# Altium schematic sheet FPGA_51_Serial.SchDoc: LiveDesign Evaluation - Serial
size A4; Organization: Altium Limited; Address1: L3, 12a Rodborough Rd; Address2: Frenchs Forest; Address3: NSW; Address4: Australia 2086; DocumentNumber: 1; SheetNumber: 1; SheetTotal: 7
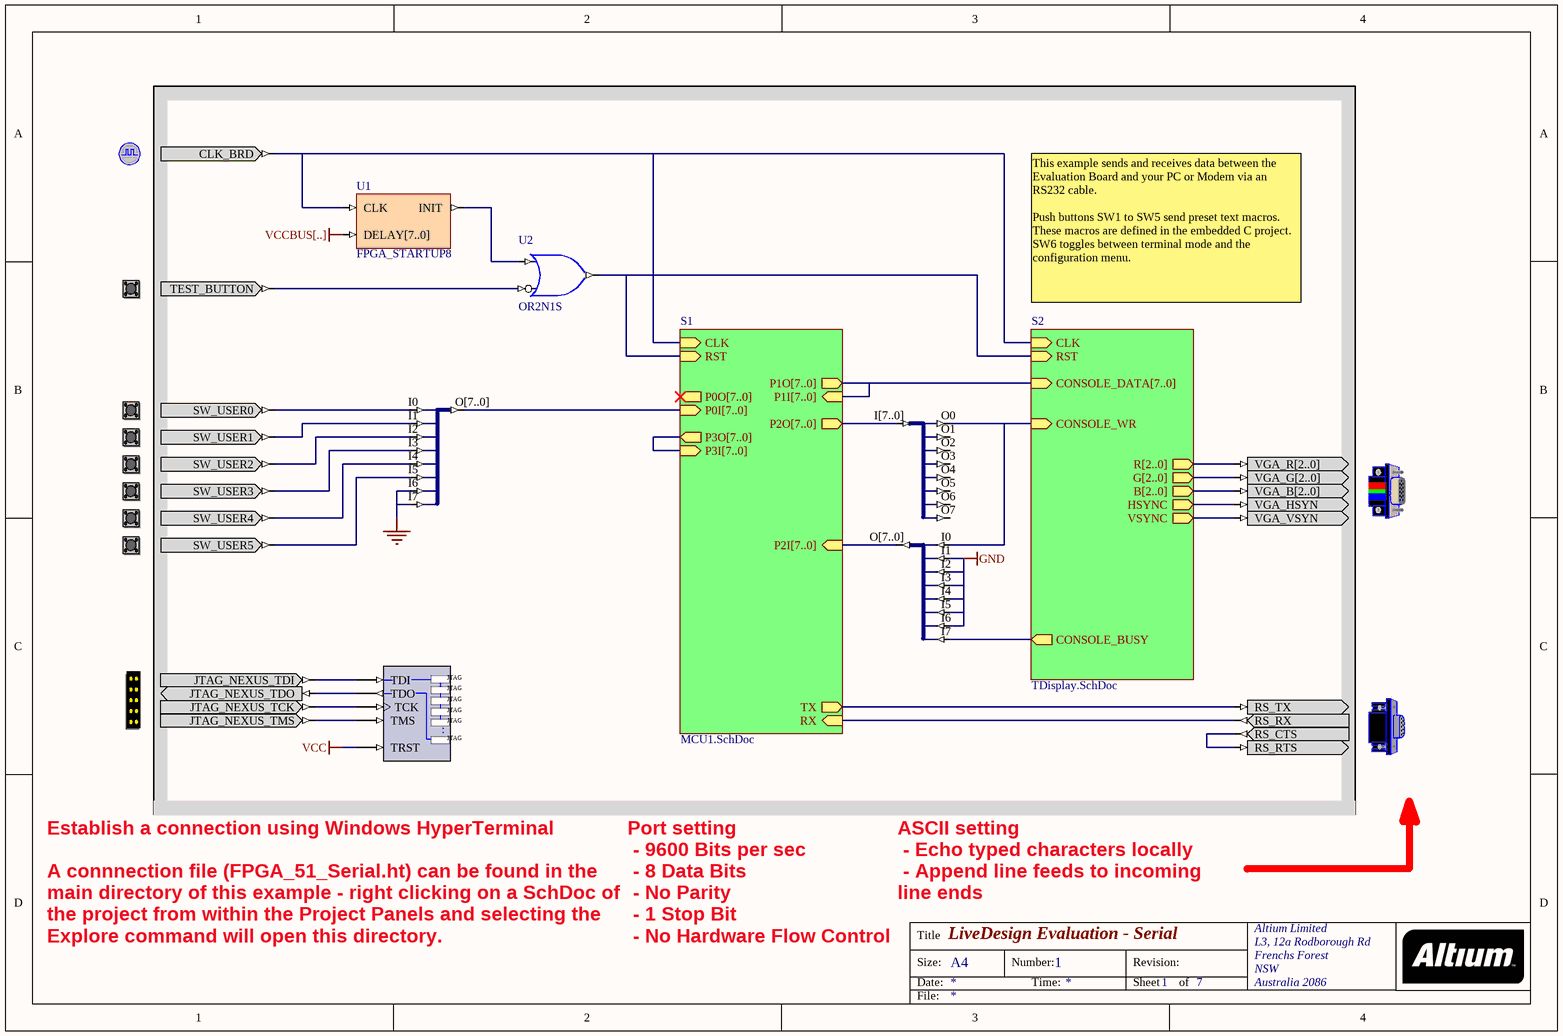
[diagram p0: FPGA_51_Serial.SchDoc]

## Parts
CLOCK_BOARD  CLOCK_BOARD  (value not drawn)
NEXUS_JTAG_CONNECTOR  NEXUS_JTAG_CONNECTOR  (value not drawn)
NEXUS_JTAG_PORT  NEXUS_JTAG_PORT  (value not drawn)
RS232CNTR  RS232CNTR  (value not drawn)
TEST_BUTTON  TEST_BUTTON  (value not drawn)
U1  FPGA_STARTUP8
U2  OR2N1S
U3  J8S_8B  (value not drawn)
U4  J8S_8B  (value not drawn)
U5  J8B_8S  (value not drawn)
USER_BUTTONX6  USER_BUTTONX6  (value not drawn)
VGACNTR  VGACNTR  (value not drawn)

## Sub-sheets
S1 = MCU1.SchDoc: CLK (in), RST (in), P0O[7..0] (out), P0I[7..0] (in), P1O[7..0] (out), P1I[7..0] (in), P2O[7..0] (out), P2I[7..0] (in), P3O[7..0] (out), P3I[7..0] (in), TX (out), RX (in)
S2 = TDisplay.SchDoc: CLK (in), HSYNC (out), VSYNC (out), R[2..0] (out), G[2..0] (out), B[2..0] (out), CONSOLE_WR (in), CONSOLE_DATA[7..0] (in), CONSOLE_BUSY (out), RST (in)

## Nets
GND: U3.I6 U3.I7 U4.I1 U4.I2 U4.I3 U4.I4 U4.I5 U4.I6
VCC: NEXUS_JTAG_PORT.TRST
VCCBUS[..]: U1.DELAY[7..0]
NetCLOCK_BOARD_CLK_BRD: CLOCK_BOARD.CLK_BRD U1.CLK ; sheet S1/CLK, sheet S2/CLK
NetNEXUS_JTAG_CONNECTOR_JTAG_NEXUS_TCK: NEXUS_JTAG_CONNECTOR.JTAG_NEXUS_TCK NEXUS_JTAG_PORT.TCK
NetNEXUS_JTAG_CONNECTOR_JTAG_NEXUS_TDI: NEXUS_JTAG_CONNECTOR.JTAG_NEXUS_TDI NEXUS_JTAG_PORT.TDI
NetNEXUS_JTAG_CONNECTOR_JTAG_NEXUS_TDO: NEXUS_JTAG_CONNECTOR.JTAG_NEXUS_TDO NEXUS_JTAG_PORT.TDO
NetNEXUS_JTAG_CONNECTOR_JTAG_NEXUS_TMS: NEXUS_JTAG_CONNECTOR.JTAG_NEXUS_TMS NEXUS_JTAG_PORT.TMS
NetRS232CNTR_RS_CTS: RS232CNTR.RS_CTS RS232CNTR.RS_RTS
NetRS232CNTR_RS_RX: RS232CNTR.RS_RX ; sheet S1/RX
NetRS232CNTR_RS_TX: RS232CNTR.RS_TX ; sheet S1/TX
NetTEST_BUTTON_TEST_BUTTON: TEST_BUTTON.TEST_BUTTON U2.I0
NetU1_INIT: U1.INIT U2.I1
NetU2_O: U2.O ; sheet S1/RST, sheet S2/RST
NetU3_I0: U3.I0 USER_BUTTONX6.SW_USER0
NetU3_I1: U3.I1 USER_BUTTONX6.SW_USER1
NetU3_I2: U3.I2 USER_BUTTONX6.SW_USER2
NetU3_I3: U3.I3 USER_BUTTONX6.SW_USER3
NetU3_I4: U3.I4 USER_BUTTONX6.SW_USER4
NetU3_I5: U3.I5 USER_BUTTONX6.SW_USER5
NetU3_O[7..0]: U3.O[7..0] ; sheet S1/P0I[7..0]
NetU4_I0: U4.I0 U5.O0 ; sheet S2/CONSOLE_WR
NetU4_I7: U4.I7 ; sheet S2/CONSOLE_BUSY
NetU4_O[7..0]: U4.O[7..0] ; sheet S1/P2I[7..0]
NetU5_I[7..0]: U5.I[7..0] ; sheet S1/P2O[7..0]
NetVGACNTR_VGA_B[2..0]: VGACNTR.VGA_B[2..0] ; sheet S2/B[2..0]
NetVGACNTR_VGA_G[2..0]: VGACNTR.VGA_G[2..0] ; sheet S2/G[2..0]
NetVGACNTR_VGA_HSYN: VGACNTR.VGA_HSYN ; sheet S2/HSYNC
NetVGACNTR_VGA_R[2..0]: VGACNTR.VGA_R[2..0] ; sheet S2/R[2..0]
NetVGACNTR_VGA_VSYN: VGACNTR.VGA_VSYN ; sheet S2/VSYNC

Not connected (* = marked no-connect by the designer): U5 O1 O2 O3 O4 O5 O6 O7

## Buses and harness runs
bus sheet S1/P1I[7..0] = sheet S1/P1O[7..0] = sheet S2/CONSOLE_DATA[7..0]
bus sheet S1/P3I[7..0] = sheet S1/P3O[7..0]

## Notes on the sheet
- This example sends and receives data between the Evaluation Board and your PC or Modem via an RS232 cable.
  Push buttons SW1 to SW5 send preset text macros. These macros are defined in the embedded C project. SW6 toggles between terminal mode and the configuration menu.
- Establish a connection using Windows HyperTerminal
  A connnection file (FPGA_51_Serial.ht) can be found in the main directory of this example - right clicking on a SchDoc of the project from within the Project Panels and selecting the Explore command will open this directory.
- Port setting
  - 9600 Bits per sec
  - 8 Data Bits
  - No Parity
  - 1 Stop Bit
  - No Hardware Flow Control
- ASCII setting
  - Echo typed characters locally
  - Append line feeds to incoming line ends
- Title
- Size:
- Date:
- A4
- Number:
- Time:
- Revision:
- Sheet
- of
- File:
- (in symbol NEXUS_JTAG_PORT) JTAG; .

## Library data of the parts
CLOCK_BOARD = CLOCK_BOARD: Global System Clock Supply; PortComponent: True; Published: 19-Nov-2003; Publisher: Altium Limited
NEXUS_JTAG_CONNECTOR = NEXUS_JTAG_CONNECTOR: JTAG Port; PortComponent: True; Published: 19-Nov-2003; Publisher: Altium Limited
NEXUS_JTAG_PORT = NEXUS_JTAG_PORT: Soft Nexus-Chain Connector; NEXUS_JTAG_CONNECTOR: True; Published: 18-Dec-2003; Publisher: Altium Limited
RS232CNTR = RS232CNTR: DCE Serial Port Connector; PortComponent: True; Published: 19-Nov-2003; Publisher: Altium Limited
TEST_BUTTON = TEST_BUTTON: Test Button; PortComponent: True; Published: 19-Nov-2003; Publisher: Altium Limited
U1 = FPGA_STARTUP8: FPGA Startup With 8 Bit Delay; Published: 21/01/2004; Publisher: Altium Hobart Technology Centre; Core Revision: 1.00.00
U2 = OR2N1S: 2-Input OR Gate with Active Low A Input, Single Pin Version; Xilinx Equivalent: OR2B1; ArchiveName: GENERIC; Published: 18-Dec-2003; Publisher: Altium Limited; Core Revision: 1.00.00
U3 = J8S_8B: 8 Single pin inputs to single 8-Bit output bus; ArchiveName: GENERIC; VHDLIB_SIM: GENERIC_LIB; Published: 29-Jan-2004; Publisher: Altium Limited; Core Revision: 1.00.00
U4 = J8S_8B: 8 Single pin inputs to single 8-Bit output bus; FunctionalClass: Bus Joiner; PortSize: 8; ArchiveName: GENERIC; VHDLIB_SIM: GENERIC_LIB; Published: 29-Jan-2004; Publisher: Altium Limited; LastRevisionNo: 1.00.00; HelpURL: CR0118 FPGA Generic Library Guide.pdf#page=305
U5 = J8B_8S: 8-Bit input bus to 8 single pin outputs; FunctionalClass: Bus Joiner; PortSize: 8; ArchiveName: GENERIC; VHDLIB_SIM: GENERIC_LIB; Published: 29-Jan-2004; Publisher: Altium Limited; LastRevisionNo: 1.00.00; HelpURL: CR0118 FPGA Generic Library Guide.pdf#page=303
USER_BUTTONX6 = USER_BUTTONX6: User Buttons; PortComponent: True; Published: 19-Nov-2003; Publisher: Altium Limited
VGACNTR = VGACNTR: VGA Dsub-15-Female-HD; PortComponent: True; Published: 19-Nov-2003; Publisher: Altium Limited